# EAGLE design synth-zodiac-gemini-envelope (EAGLE 9.6.2)
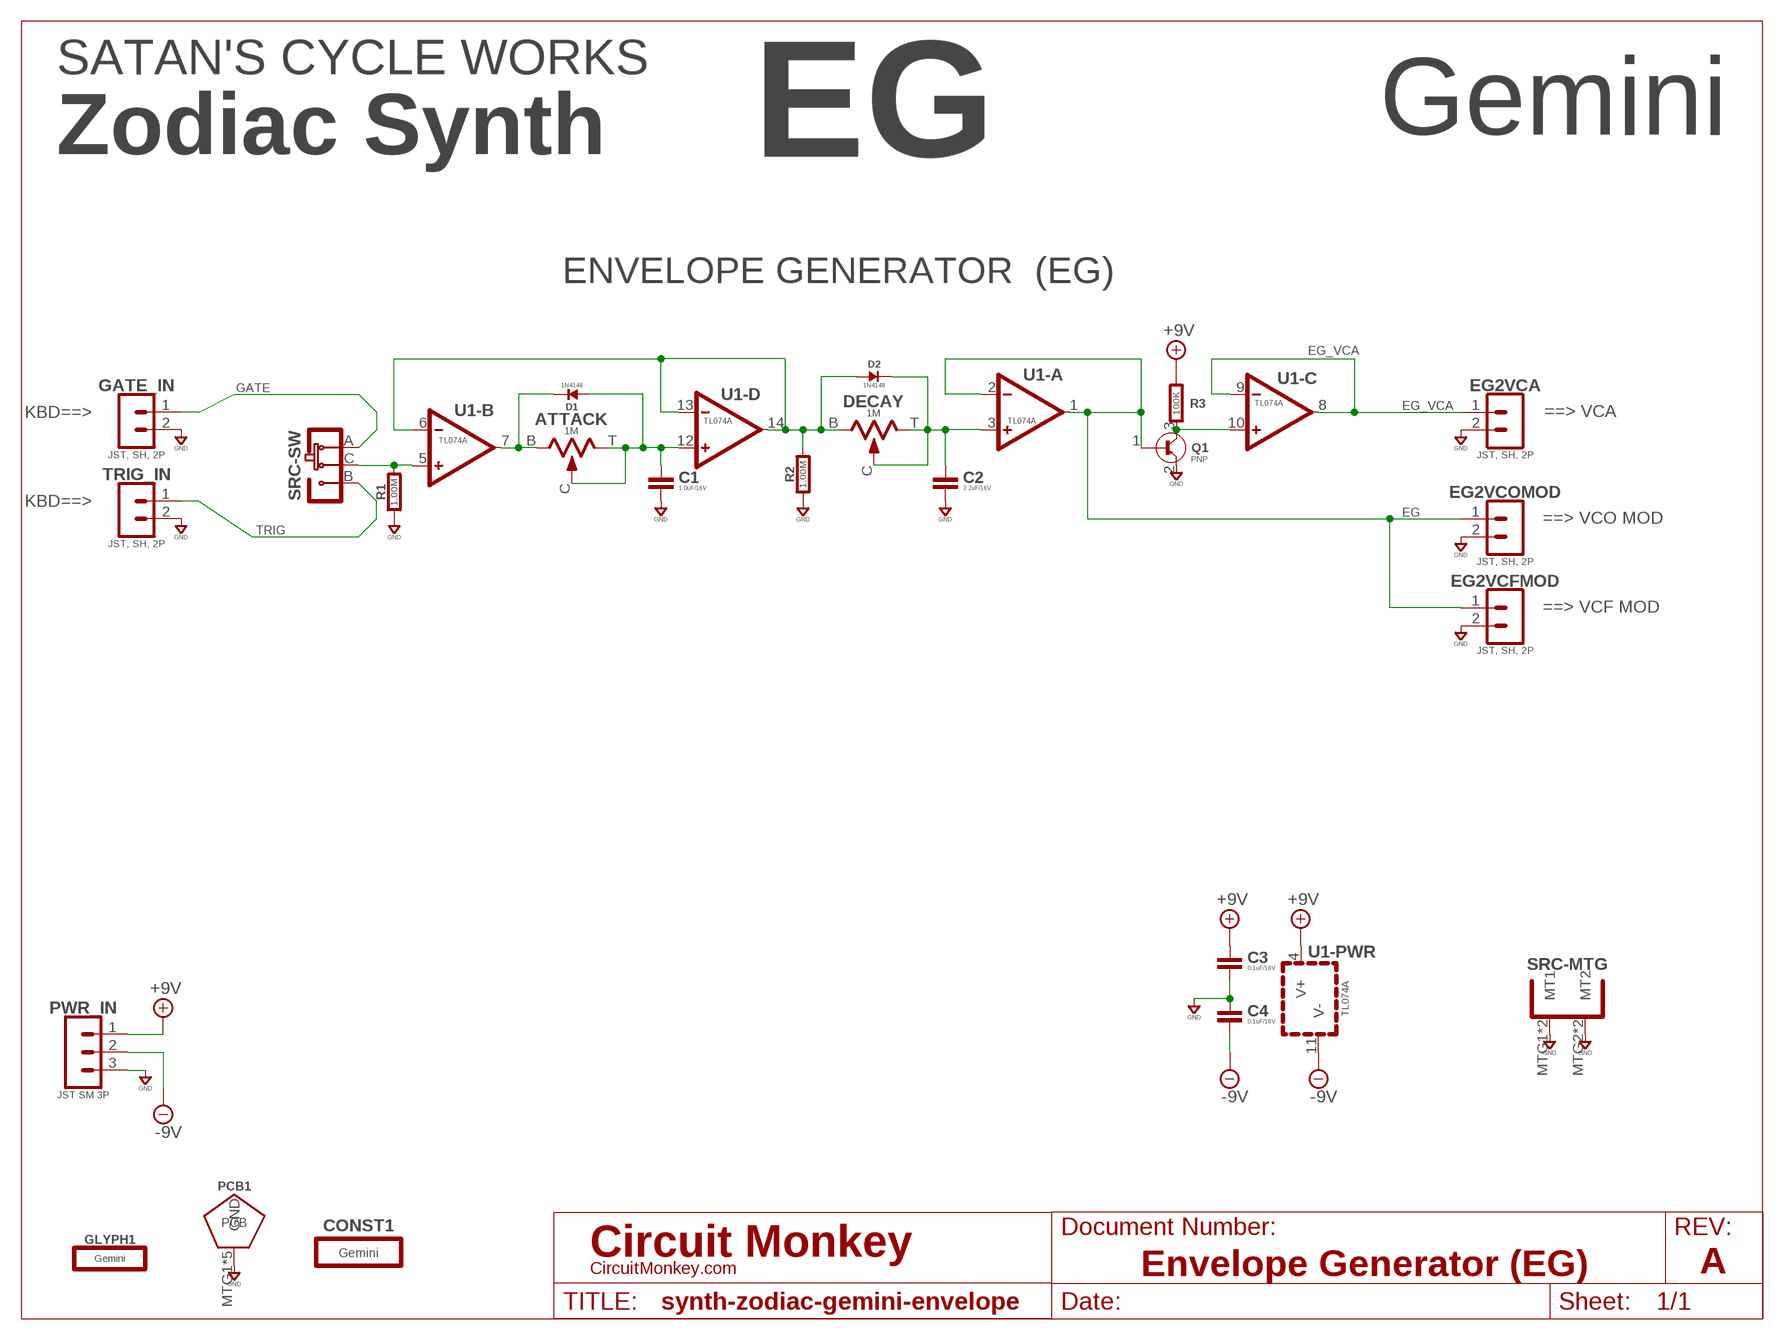
[diagram p0: schematic, sheet 1]
SHEET5 (LETTER_L-CIRCUITMONKEY): DOCUMENT_NUMBER: Envelope Generator (EG); REV: A

## Parts
ATTACK  1M  TRIMPOT9MM_PCB_SHAFT  [POT-RV9110]
C1  1.0uF/16V  CAPACITOR0603  [0603-CAP]
C2  2.2uF/16V  CAPACITOR0603  [0603-CAP]
C3  0.1uF/16V  CAPACITOR0603  [0603-CAP]
C4  0.1uF/16V  CAPACITOR0603  [0603-CAP]
CONST1  Gemini  CONSTELLATION-GEMINI  [GEMINI-CONST]
D1  1N4148  DIODE-1N4148  [SOD-123]
D2  1N4148  DIODE-1N4148  [SOD-123]
DECAY  1M  TRIMPOT9MM_PCB_SHAFT  [POT-RV9110]
EG2VCA  JST, SH, 2P  02P-SM-VT-SMT  [BM02B-SRSS-TB]
EG2VCFMOD  JST, SH, 2P  02P-SM-VT-SMT  [BM02B-SRSS-TB]
EG2VCOMOD  JST, SH, 2P  02P-SM-VT-SMT  [BM02B-SRSS-TB]
GATE_IN  JST, SH, 2P  02P-SM-VT-SMT  [BM02B-SRSS-TB]
GLYPH1  Gemini  GLYPH-GEMINI  [GEMINI-GLYPH]
PCB1  PCB FAB  PENTAGON-40R  [PENTAGON-40MM-RAD]
PWR_IN  JST SM 3P  03P-SM-VT-SMT  [BM03B-SRSS-TB]
Q1  PNP  PNP-BC856  [SOT-23]
R1  1.00M  RESISTOR0603  [0603-RES]
R2  1.00M  RESISTOR0603  [0603-RES]
R3  100K  RESISTOR0603  [0603-RES]
SRC  SLIDE-SPDT-MNTSS-12-F45-TH-PCB-2  [SS-12-F45-PNL-SMT-2]
TRIG_IN  JST, SH, 2P  02P-SM-VT-SMT  [BM02B-SRSS-TB]
U1  TL074A  QUADTL074A-SOIC  [SOP14]

## Nets
+9V: C3.1 PWR_IN.1 R3.2 U1.4(-PWR:V+)
-9V: C4.2 PWR_IN.2 U1.11(-PWR:V-)
EG: EG2VCFMOD.1 EG2VCOMOD.1 Q1.1(BASE) U1.1(-A:OUT) U1.2(-A:-)
EG_VCA: EG2VCA.1 U1.8(-C:OUT) U1.9(-C:-)
GATE: GATE_IN.1 SRC.A(-SW:A)
GND: C1.2 C2.2 C3.2 C4.1 EG2VCA.2 EG2VCFMOD.2 EG2VCOMOD.2 GATE_IN.2 PCB1.MTG1(GND) PCB1.MTG2(GND) PCB1.MTG3(GND) PCB1.MTG4(GND) PCB1.MTG5(GND) PWR_IN.3 Q1.2(EMITTER) R1.1 R2.1 SRC.MTG1(-MTG:MT1) SRC.MTG2(-MTG:MT2) SRC.MTG3(-MTG:MT1) SRC.MTG4(-MTG:MT2) TRIG_IN.2
N$134: R1.2 SRC.C(-SW:C) U1.5(-B:+)
N$136: ATTACK.B D1.K U1.7(-B:OUT)
N$137: ATTACK.C ATTACK.T C1.1 D1.A U1.12(-D:+)
N$138: C2.1 D2.K DECAY.C DECAY.T U1.3(-A:+)
N$139: D2.A DECAY.B R2.2 U1.6(-B:-) U1.13(-D:-) U1.14(-D:OUT)
N$140: Q1.3(COLLECTOR) R3.1 U1.10(-C:+)
TRIG: SRC.B(-SW:B) TRIG_IN.1

## Notes on the sheet
- EG | Gemini
- SATAN'S CYCLE WORKS
- Zodiac Synth
- ENVELOPE GENERATOR  (EG)
- KBD==>
- ==> VCA
- KBD==>
- ==> VCO MOD
- ==> VCF MOD

## Library data of the parts
ATTACK DECAY = rlc:TRIMPOT: Potentiometer; COST01: 0.70; COST10: 0.60; COST100: 0.60; MFR: Tayda; MPN: RV9110NO-OS15A00; SKU: A-5517
C1-C4 = rlc:CAPACITOR: Capacitor; COST01: 0.12; COST10: 0.09; COST100: 0.05
CONST1 = circuit-monkey-zodiac:CONSTELLATION: Constellations
D1 D2 = diodes:DIODE-: Diode; COST01: 0.20; COST10: 0.18; COST100: 0.10; MPN: 1N4148W
EG2VCA EG2VCFMOD EG2VCOMOD GATE_IN TRIG_IN = con-jst:02P: 2 pin connector; COST01: 0.45; COST10: 0.4; COST100: 0.35; MFR: JST; MPN: BMB02B-SRSS-TB
GLYPH1 = circuit-monkey-zodiac:GLYPH: Glyph
PCB1 = circuit-monkey-zodiac:PENTAGON: Pentagram shaped PCB
PWR_IN = con-jst:03P: 3 pin connector; COST01: 0.60; COST10: 0.45; COST100: 0.38; MFR: JST; MPN: BM03B-SRSS-TB
Q1 = transistor-bjt:PNP: PNP BJ Transistor; MFR: On Semiconductor; MOUSER: https://www.mouser.com/ProductDetail/ON-Semiconductor/BC856BLT1G; MPN: BC856
R1-R3 = rlc:RESISTOR: Resistor; COST01: 0.10; COST10: 0.05; COST100: 0.02
SRC = switch-thd:SLIDE-SPDT-MNT: Slide Switch, SPDT; COST01: 0.15; COST10: 0.12; COST100: 0.12; MFR: Tayda; MPN: A-659/A-5111/A-5104
U1 = op-amp:QUAD: Quad Op-amp; COST01: 0.95; COST10: 0.70; COST100: 0.55; MFR: ST; MPN: TL074ACDT

## Board
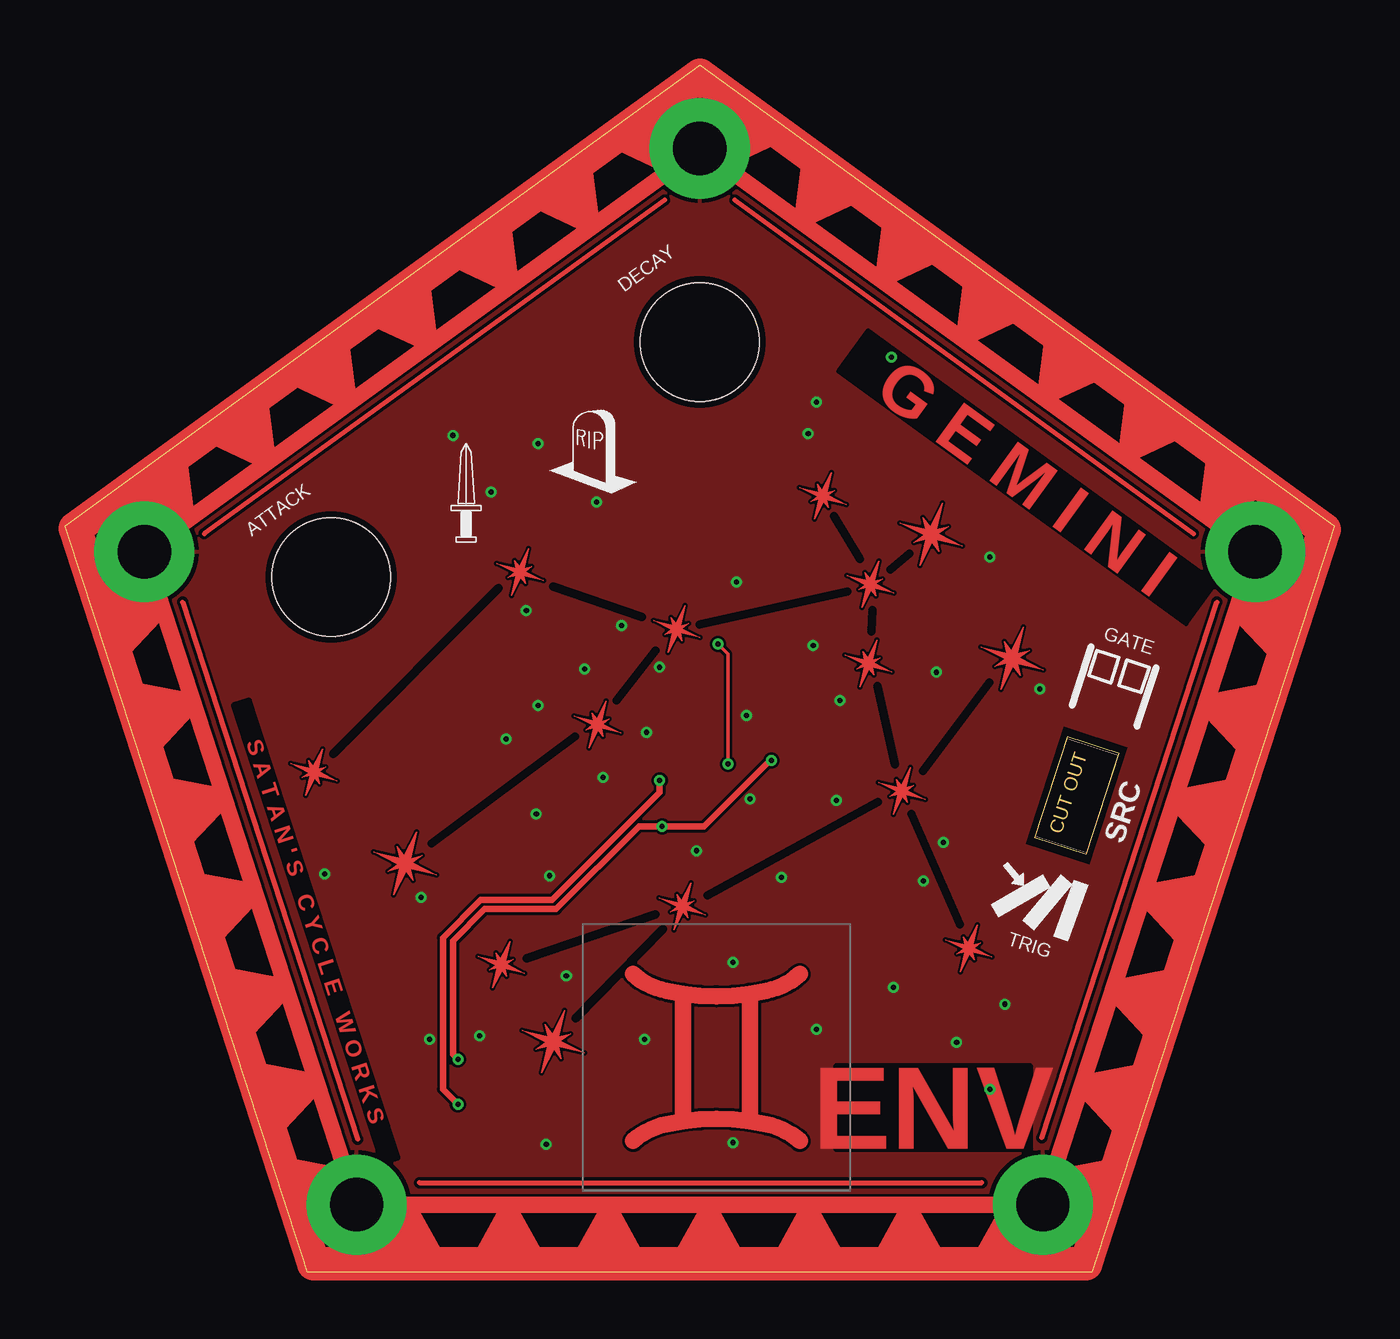
[diagram p1: board, top side]
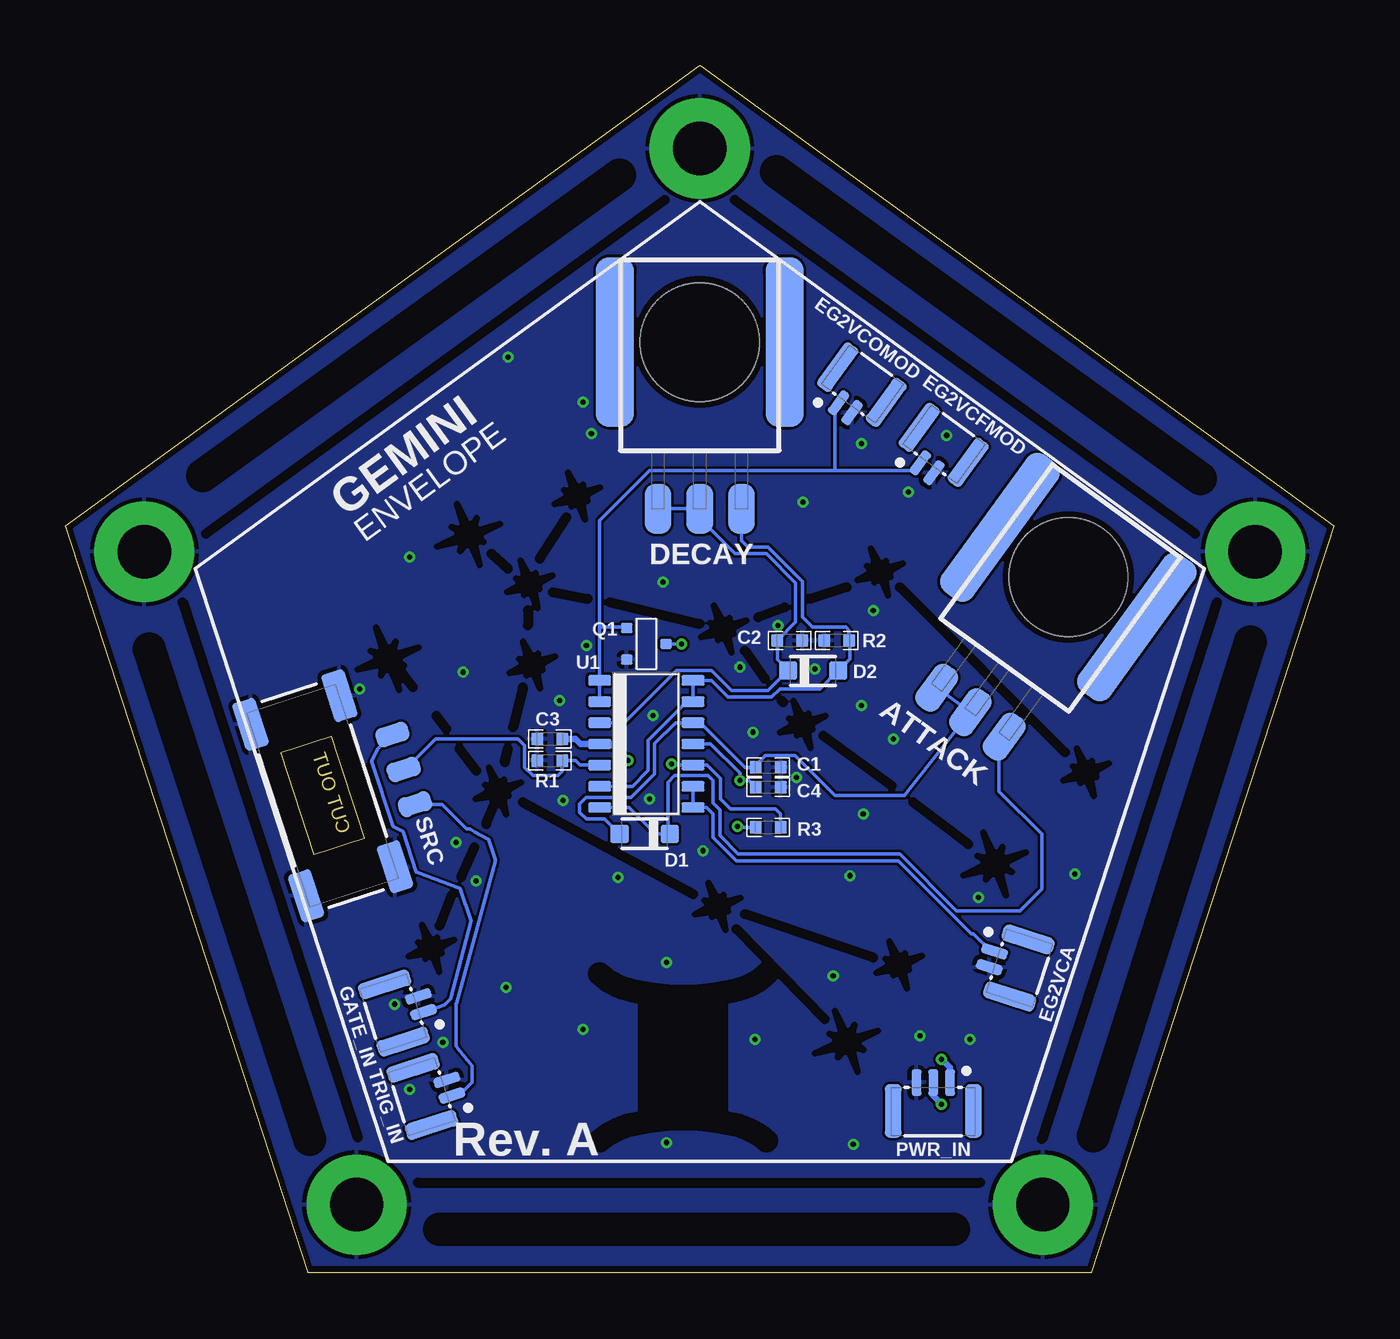
[diagram p2: board, bottom side, seen from below]

Size 76.08 x 72.36 mm. Coordinates in mm from the lower left corner, seen from the top.
Copper layers (1*16): Top 0.0356mm / dielectric 1.5011mm / Bottom 0.0356mm
Design rules "OSH-CircuitMonkey *": minimum track width 6mil, minimum drill 12mil, track to track 6mil, track to pad 6mil, pad to pad 6mil, via to via 6mil, smd to smd 6mil, copper to edge 15mil, drill to drill 6mil, minimum pad ring 7mil, minimum via ring 7mil, stop-mask expansion 3mil, vias tented up to drill 15mil, thermal gap 10mil
bRestrict: 23 lines

### Footprints (pad centres in the part's own frame; a part is rotated, then mirrored left to right if it is on the bottom)
POT-RV9110 = smd 1.6 x 3: B 2.5,-10; C 0,-10; T -2.5,-10 | smd 2.286 x 10.16: MNT1 -5.08,0; MNT2 5.08,0 | hole 7.1: 0,0
0603-CAP = smd 0.711 x 0.762: 1 -0.752,0; 2 0.752,0
SOD-123 = smd 1.1 x 1.1: A 1.5,0; K -1.5,0
BM02B-SRSS-TB = smd 0.6 x 1.6: 1 -0.5,-0.3; 2 0.5,-0.3 | smd 1 x 3.2: MTG1 1.8,1.4; MTG2 -1.8,1.4
PENTAGON-40MM-RAD = drill 3.2 pad 6: MTG1 0,35; MTG2 33.3,10.82; MTG3 20.57,-28.32; MTG4 -20.57,-28.32; MTG5 -33.3,10.82
BM03B-SRSS-TB = smd 0.6 x 1.6: 1 -1,-0.3; 2 0,-0.3; 3 1,-0.3 | smd 1 x 3.2: MTG1 2.4,1.4; MTG2 -2.4,1.4
SOT-23 = smd 0.6 x 0.7: 1 -0.95,-1.18; 2 0.95,-1.18; 3 0,1.18
0603-RES = smd 0.711 x 0.762: 1 -0.752,0; 2 0.752,0
SS-12-F45-PNL-SMT-2 = smd 1.2 x 2 bottom: A -2.2,-5.1; B 2.2,-5.1; C 0,-5.1 | smd 3 x 1.4 bottom: MTG1 -5.4,2.8; MTG2 5.4,2.8; MTG3 -5.4,-2.8; MTG4 5.4,-2.8
SOP14 = smd 1.4 x 0.635: 1 -2.8,3.81 | smd 1.4 x 0.63: 2 -2.8,2.54; 3 -2.8,1.27; 4 -2.8,0; 5 -2.8,-1.27; 6 -2.8,-2.54; 7 -2.8,-3.81; 8 2.8,-3.81; 9 2.8,-2.54; 10 2.8,-1.27; 11 2.8,0; 12 2.8,1.27; 13 2.8,2.54; 14 2.8,3.81

### Placement (x,y rotation side)
ATTACK  15.94,41.66 324 bottom
C1  33.94,30.26 0 bottom
C2  32.64,37.86 0 bottom
C3  47.04,31.96 180 bottom
C4  33.94,29.06 180 bottom
CONST1  37.04,29.36 340 top
D1  41.34,26.26 180 bottom
D2  31.24,36.06 0 bottom
DECAY  38.04,55.76 0 bottom
EG2VCA  20.24,18.66 252 bottom
EG2VCFMOD  24.24,48.46 324 bottom
EG2VCOMOD  29.14,52.06 324 bottom
GATE_IN  55.04,15.96 108 bottom
GLYPH1  39.04,12.86 0 top
PCB1  38.04,32.36 0 top
PWR_IN  24.04,11.06 180 bottom
Q1  41.24,37.66 270 bottom
R1  47.04,30.66 0 bottom
R2  29.84,37.86 0 bottom
R3  33.94,26.66 180 bottom
SRC  60.64,28.56 252 top
TRIG_IN  53.34,10.96 108 bottom
U1  41.24,31.66 0 bottom

### Tracks (layer width: path | path; a pad name or v marks a point on that pad's centre or on a via)
+9V  (via drill 0.3)
  Top 0.4: v23.54,12.76 23.24,13.06 23.24,19.86 25.14,21.76 29.44,21.76 34.39,26.71 v35.79,26.71 38.29,26.71 42.24,30.66 v42.34,30.66
  Bottom 0.2: v35.79,26.71 35.74,26.66 R3.2
  Bottom 0.4: C3.1 45.49,31.96 45.2,31.67 U1.4 43.34,31.66 v42.34,30.66 | PWR_IN.1 23.04,12.26 v23.54,12.76
-9V  (via drill 0.3)
  Top 0.4: v35.64,29.46 35.64,28.76 29.19,22.31 24.91,22.31 22.64,20.04 22.64,10.96 v23.54,10.06
  Bottom 0.2: U1.11 37.4,31.66 35.64,29.91 v35.64,29.46 35.09,29.46 C4.2
  Bottom 0.4: PWR_IN.2 24.04,10.56 v23.54,10.06
EG
  Bottom 0.2: U1.2 U1.1 44.04,38.66 | EG2VCFMOD.1 24.82,48.41 25.17,48.06 29.94,48.06 | 44.04,38.66 44.04,45.06 41.04,48.06 29.94,48.06 | EG2VCOMOD.1 29.94,51.89 29.94,48.06 | Q1.1 42.47,38.66 44.04,38.66
EG_VCA
  Bottom 0.2: U1.9 U1.8 37.64,27.85 37.24,27.45 37.24,26.06 35.84,24.66 26.14,24.66 21.76,20.28 21.62,20.28 20.57,19.23 EG2VCA.1
GATE
  Bottom 0.2: GATE_IN.1 53.34,16.01 52.99,16.39 51.75,21.06 52.42,23 55.04,23.99 55.83,26.4 56.42,26.7 57.72,30.6 57.35,31.35 SRC.A
GND  (via drill 0.3)
  other vias: 58.44,34.96 55.44,42.86 44.84,37.56 46.24,28.26 52.64,25.76 51.44,23.46 34.74,13.96 24.84,14.16 29.04,23.76 26.44,31.96 28.24,27.46 31.14,36.16 28.34,49.66 25.54,46.76 23.24,50.16 30.04,17.76 21.84,13.96 45.04,14.56 56.34,16.06 49.64,17.06 49.54,54.86 44.54,50.26 45.04,52.16 46.44,34.26 34.84,32.36 42.94,23.66 31.84,46.16 28.84,7.66 52.24,35.96 40.84,33.36 37.84,25.26 40.04,7.76 15.54,23.86 21.34,22.46 40.04,18.56 32.24,29.66 40.24,41.36 28.34,33.96 27.64,39.66 35.64,36.26 33.34,38.76 55.44,10.96 41.04,28.36 53.44,13.76
  pour Top (rank 4): 17.04,4.36 58.04,4.36 71.04,43.36 38.04,67.36 5.04,43.36
  pour Bottom (rank 4): 14.54,-0.14 61.54,-0.14 76.04,44.86 38.04,72.36 0.04,44.86
N$134
  Bottom 0.2: U1.5 45.22,30.39 45.49,30.66 R1.2 46.29,30.01 46.54,29.76 48.04,29.76 48.54,30.26 48.54,31.56 48.94,31.96 53.87,31.96 55.69,30.14 SRC.C
N$136
  Bottom 0.2: ATTACK.B 19.8,31.4 20.1,31.1 20.1,28.82 17.54,26.26 17.54,22.96 18.84,21.66 22.64,21.66 26.05,25.07 26.06,25.06 35.74,25.06 36.84,26.16 36.84,27.71 37.25,28.11 37.25,29.46 37.54,29.76 39.54,29.76 39.94,29.36 39.94,26.36 D1.K 40.68,26.26 42.27,27.85 U1.7
N$137
  Bottom 0.2: ATTACK.T ATTACK.C 22.14,33.25 22.14,33.17 25.77,28.56 29.94,28.56 32.34,30.96 34.09,30.96 34.69,30.36 C1.1 35.33,30.26 38,32.93 U1.12 39.49,32.93 40.74,31.68 40.74,29.86 42.15,28.45 44.85,28.45 45.24,28.06 45.24,27.56 44.84,27.16 43.74,27.16 D1.A
N$138
  Bottom 0.2: DECAY.T DECAY.C 38.04,45.16 35.94,43.06 34.04,43.06 32.29,41.31 32.29,38.96 C2.1 33.39,36.71 D2.K 33.94,34.86 36.14,34.86 37.34,36.06 39.44,36.06 42.57,32.93 U1.3
N$139
  Bottom 0.2: U1.6 42.08,29.12 41.14,30.06 41.14,31.86 38.8,34.2 U1.13 U1.14 37.35,35.47 36.34,34.46 33.74,34.46 33.24,34.96 30.84,34.96 D2.A 29.04,36.76 29.04,37.86 R2.2 29.09,38.46 29.29,38.66 31.29,38.66 31.89,39.26 31.89,41.41 33.94,43.46 35.14,43.46 35.54,43.86 DECAY.B
N$140  (via drill 0.3)
  Top 0.2: v39.74,30.46 39.74,37.06 v39.14,37.66
  Bottom 0.2: R3.1 33.19,27.46 33.49,27.76 36.19,27.76 36.79,28.36 36.79,29.59 37.59,30.39 U1.10 39.67,30.39 v39.74,30.46 | v39.14,37.66 Q1.3
TRIG
  Bottom 0.2: TRIG_IN.1 52.5,10.58 51.7,11.38 51.7,12.35 52.53,13.39 52.64,13.56 52.64,16.09 52.64,16.1 50.27,24.68 50.7,25.95 51.54,26.39 51.82,26.56 52.01,26.56 53.49,28.04 SRC.B

### Text on the board
Top: G E M I N I | S A T A N ' S C Y C L E W O R K S | ENV
tPlace: GATE | TRIG
bPlace: ENVELOPE | GEMINI | Rev. A
tStop: G E M I N I | S A T A N ' S C Y C L E W O R K S | ENV